# Altium schematic sheet Sheet2.SchDoc
size A2; SheetNumber: 1; SheetTotal: 1
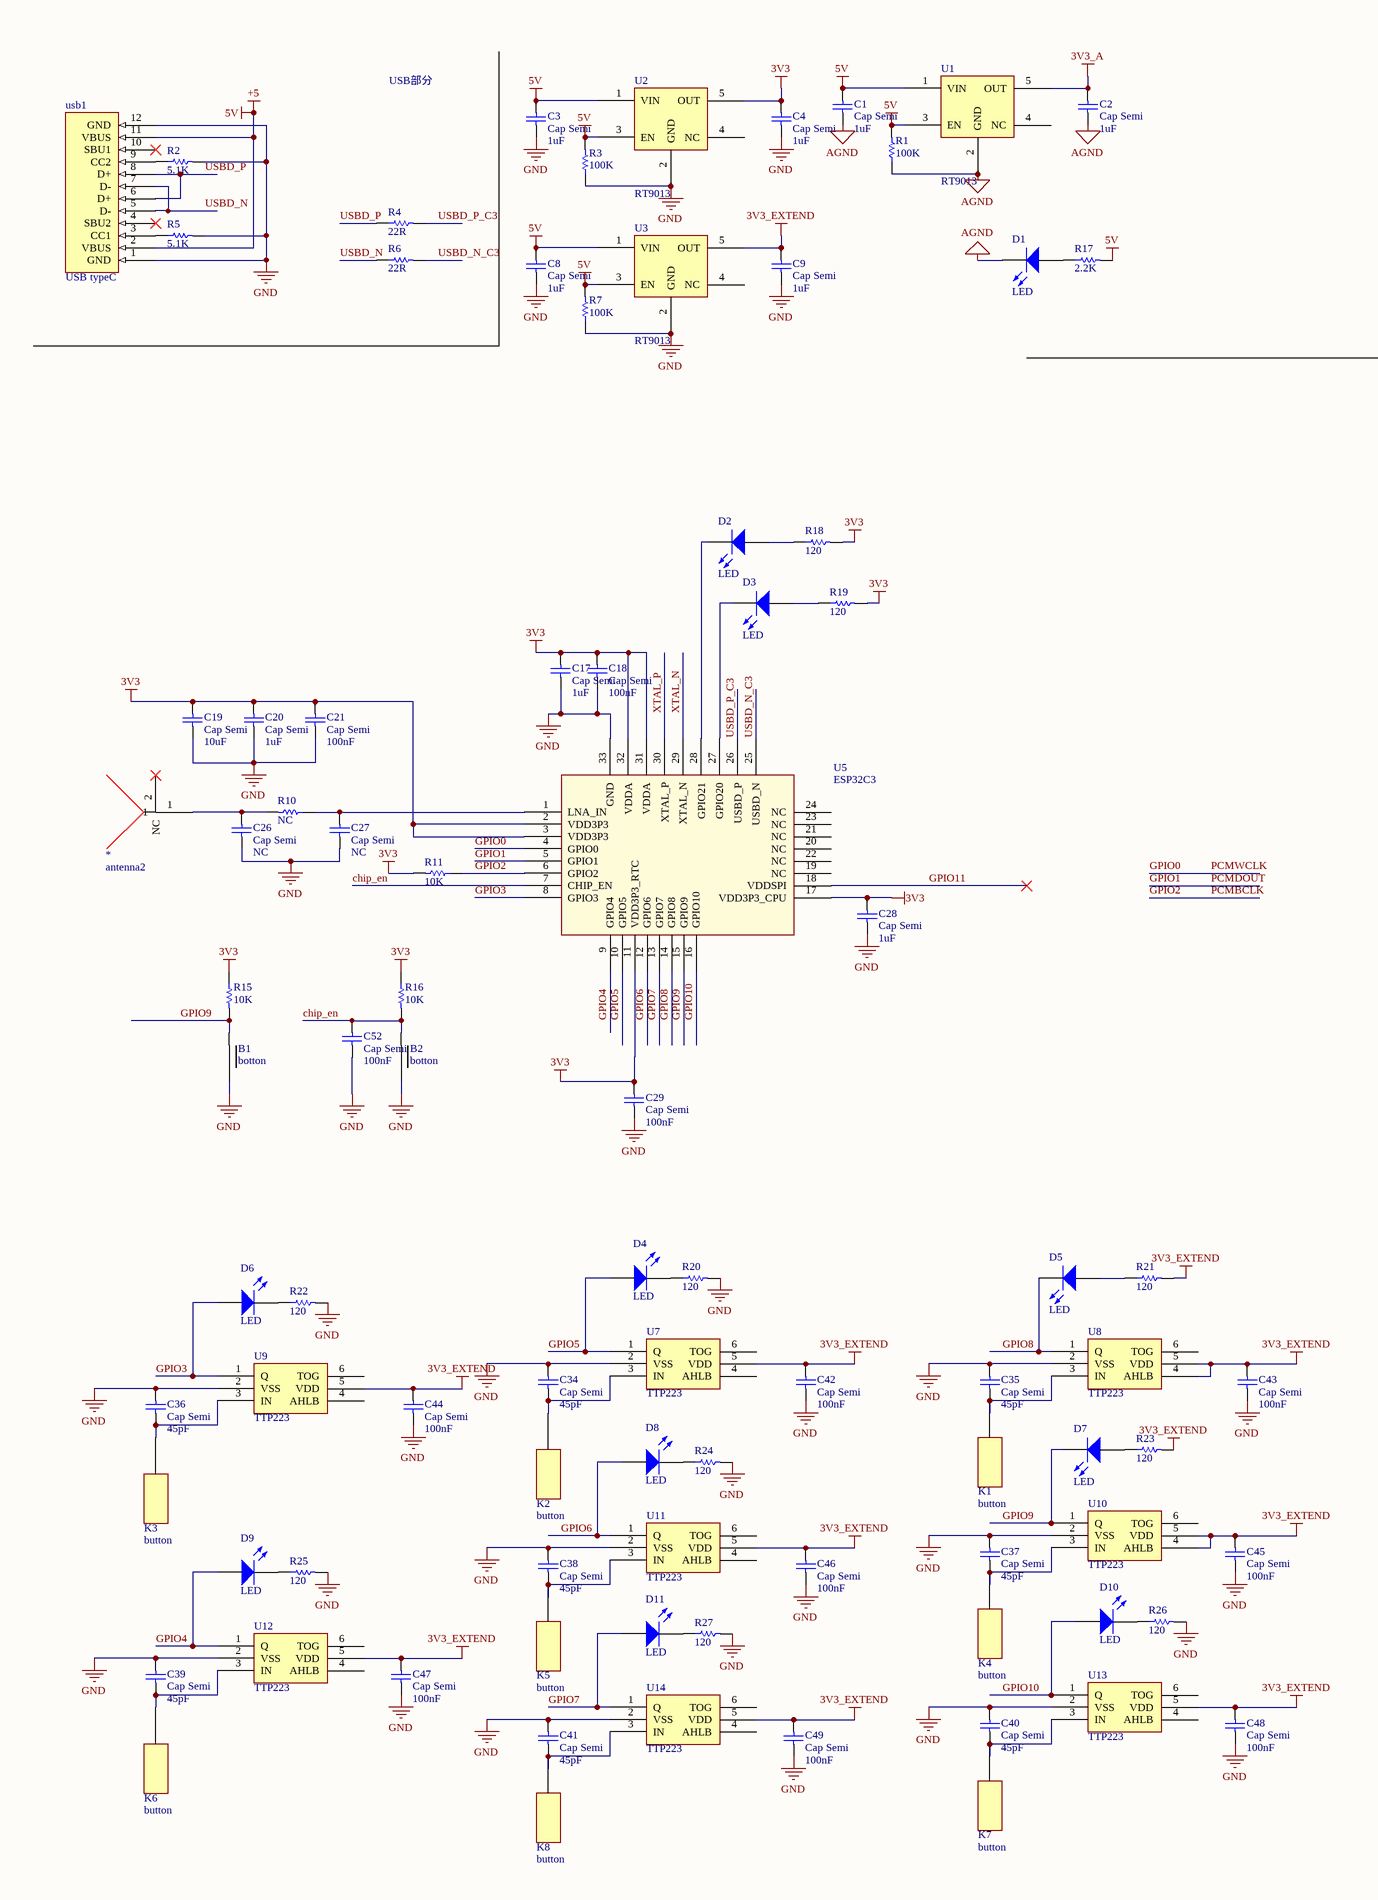
[diagram p0: Sheet2.SchDoc, left]
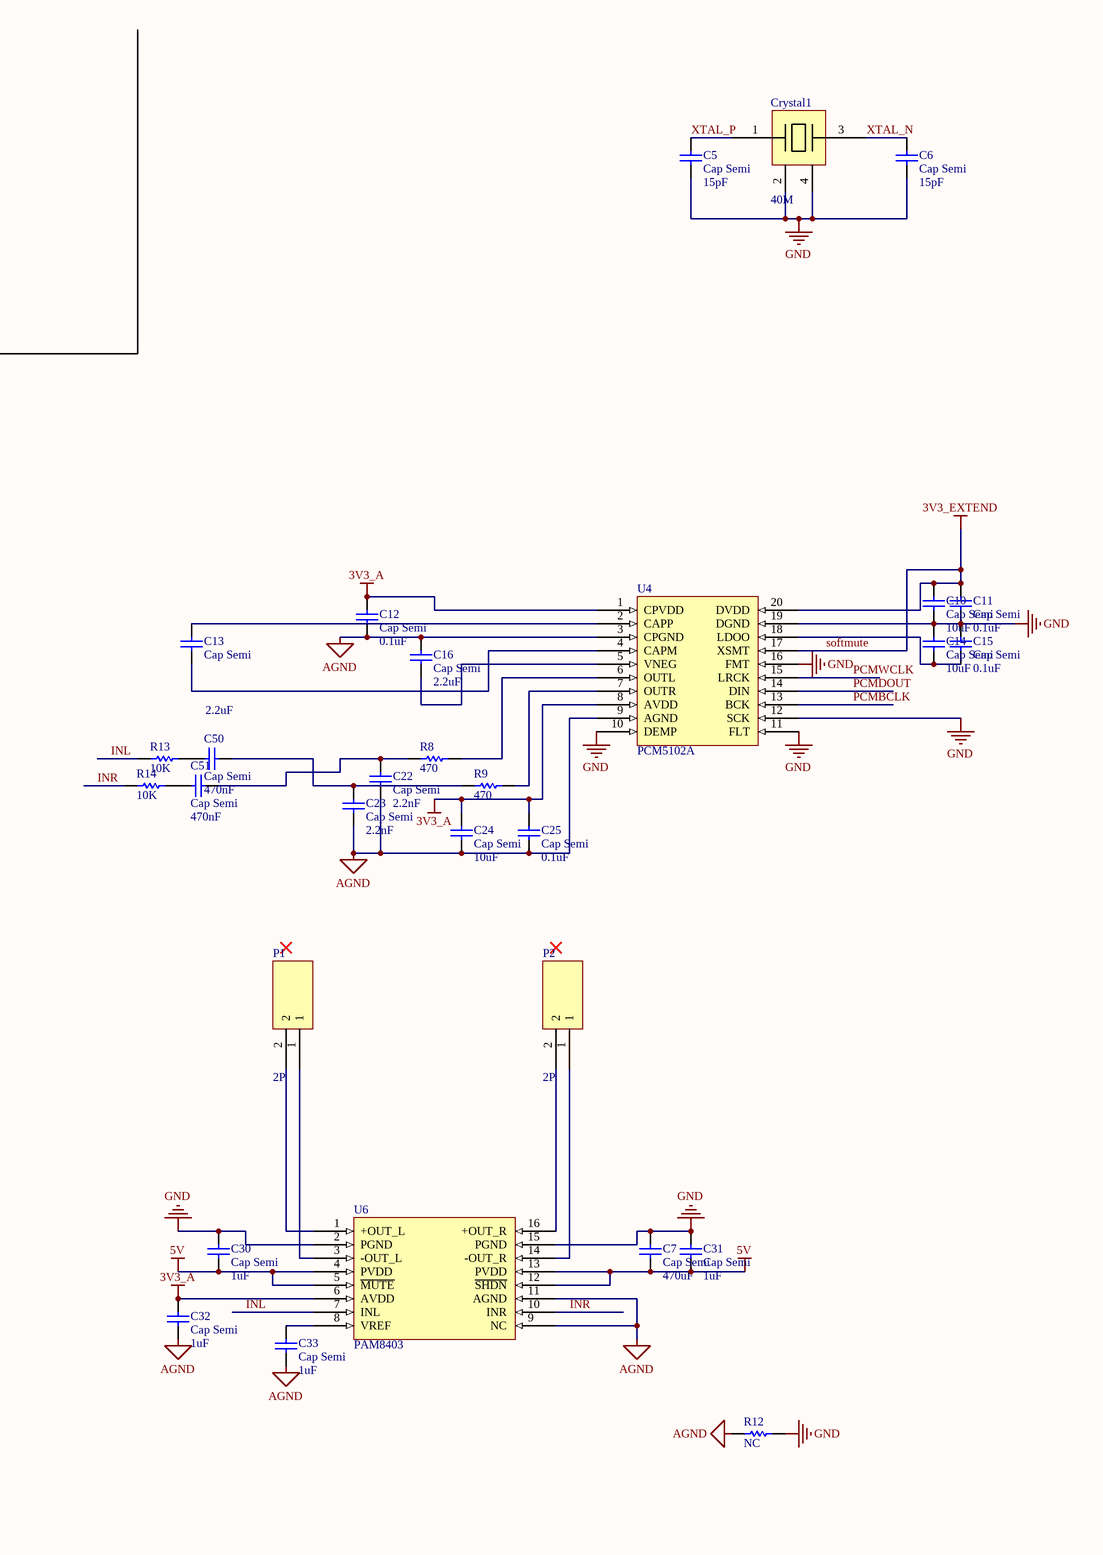
[diagram p1: Sheet2.SchDoc, right]

## Parts
*  antenna2  [antana]
B1  botton  [BOTTON_3*4]
B2  botton  [BOTTON_3*4]
C1  Cap Semi  value 1uF  [C1608[0603]]
C2  Cap Semi  value 1uF  [C1608[0603]]
C3  Cap Semi  value 1uF  [C1608[0603]]
C4  Cap Semi  value 1uF  [C1608[0603]]
C5  Cap Semi  value 15pF  [C1608[0603]]
C6  Cap Semi  value 15pF  [C1608[0603]]
C7  Cap Semi  value 470uF  [C1206]
C8  Cap Semi  value 1uF  [C1608[0603]]
C9  Cap Semi  value 1uF  [C1608[0603]]
C10  Cap Semi  value 10uF  [C1608[0603]]
C11  Cap Semi  value 0.1uF  [C1608[0603]]
C12  Cap Semi  value 0.1uF  [C1608[0603]]
C13  Cap Semi  value 2.2uF  [C1608[0603]]
C14  Cap Semi  value 10uF  [C1608[0603]]
C15  Cap Semi  value 0.1uF  [C1608[0603]]
C16  Cap Semi  value 2.2uF  [C1608[0603]]
C17  Cap Semi  value 1uF  [C1608[0603]]
C18  Cap Semi  value 100nF  [C1608[0603]]
C19  Cap Semi  value 10uF  [C0805]
C20  Cap Semi  value 1uF  [C1608[0603]]
C21  Cap Semi  value 100nF  [C1608[0603]]
C22  Cap Semi  value 2.2nF  [C1608[0603]]
C23  Cap Semi  value 2.2nF  [C1608[0603]]
C24  Cap Semi  value 10uF  [C1608[0603]]
C25  Cap Semi  value 0.1uF  [C1608[0603]]
C26  Cap Semi  value NC  [C1608[0603]]
C27  Cap Semi  value NC  [C1608[0603]]
C28  Cap Semi  value 1uF  [C1608[0603]]
C29  Cap Semi  value 100nF  [C1608[0603]]
C30  Cap Semi  value 1uF  [C1608[0603]]
C31  Cap Semi  value 1uF  [C1608[0603]]
C32  Cap Semi  value 1uF  [C1608[0603]]
C33  Cap Semi  value 1uF  [C1608[0603]]
C34  Cap Semi  value 45pF  [C1608[0603]]
C35  Cap Semi  value 45pF  [C1608[0603]]
C36  Cap Semi  value 45pF  [C1608[0603]]
C37  Cap Semi  value 45pF  [C1608[0603]]
C38  Cap Semi  value 45pF  [C1608[0603]]
C39  Cap Semi  value 45pF  [C1608[0603]]
C40  Cap Semi  value 45pF  [C1608[0603]]
C41  Cap Semi  value 45pF  [C1608[0603]]
C42  Cap Semi  value 100nF  [C1608[0603]]
C43  Cap Semi  value 100nF  [C1608[0603]]
C44  Cap Semi  value 100nF  [C1608[0603]]
C45  Cap Semi  value 100nF  [C1608[0603]]
C46  Cap Semi  value 100nF  [C1608[0603]]
C47  Cap Semi  value 100nF  [C1608[0603]]
C48  Cap Semi  value 100nF  [C1608[0603]]
C49  Cap Semi  value 100nF  [C1608[0603]]
C50  Cap Semi  value 470nF  [C1608[0603]]
C51  Cap Semi  value 470nF  [C1608[0603]]
C52  Cap Semi  value 100nF  [C1608[0603]]
Crystal1  40M  [3225 Crytsl]
D1  LED  [LED_0805]
D2  LED  [LED_0805]
D3  LED  [LED_0805]
D4  LED  [LED_0805]
D5  LED  [LED_0805]
D6  LED  [LED_0805]
D7  LED  [LED_0805]
D8  LED  [LED_0805]
D9  LED  [LED_0805]
D10  LED  [LED_0805]
D11  LED  [LED_0805]
K1  button  [button_touch]
K2  button  [button_touch]
K3  button  [button_touch]
K4  button  [button_touch]
K5  button  [button_touch]
K6  button  [button_touch]
K7  button  [button_touch]
K8  button  [button_touch]
P1  2P  [2Px1.25]
P2  2P  [2Px1.25]
R1  value 100K  [R0603]  (hidden comment: Res Semi)
R2  value 5.1K  [R0603]  (hidden comment: Res Semi)
R3  value 100K  [R0603]  (hidden comment: Res Semi)
R4  value 22R  [R0603]  (hidden comment: Res Semi)
R5  value 5.1K  [R0603]  (hidden comment: Res Semi)
R6  value 22R  [R0603]  (hidden comment: Res Semi)
R7  value 100K  [R0603]  (hidden comment: Res Semi)
R8  value 470  [R0603]  (hidden comment: Res Semi)
R9  value 470  [R0603]  (hidden comment: Res Semi)
R10  value NC  [R0603]  (hidden comment: Res Semi)
R11  value 10K  [R0603]  (hidden comment: Res Semi)
R12  value NC  [sigle_ground]  (hidden comment: Res Semi)
R13  value 10K  [R0603]  (hidden comment: Res Semi)
R14  value 10K  [R0603]  (hidden comment: Res Semi)
R15  value 10K  [R0603]  (hidden comment: Res Semi)
R16  value 10K  [R0603]  (hidden comment: Res Semi)
R17  value 2.2K  [R0805]  (hidden comment: Res Semi)
R18  value 120  [R0805]  (hidden comment: Res Semi)
R19  value 120  [R0805]  (hidden comment: Res Semi)
R20  value 120  [R0805]  (hidden comment: Res Semi)
R21  value 120  [R0805]  (hidden comment: Res Semi)
R22  value 120  [R0805]  (hidden comment: Res Semi)
R23  value 120  [R0805]  (hidden comment: Res Semi)
R24  value 120  [R0805]  (hidden comment: Res Semi)
R25  value 120  [R0805]  (hidden comment: Res Semi)
R26  value 120  [R0805]  (hidden comment: Res Semi)
R27  value 120  [R0805]  (hidden comment: Res Semi)
U1  RT9013  [SOT23-5]
U2  RT9013  [SOT23-5]
U3  RT9013  [SOT23-5]
U4  PCM5102A  [TSSOP20]
U5  ESP32C3  [QFN32 5x5_M]
U6  PAM8403  [SOP16]
U7  TTP223  [SOT23-6]
U8  TTP223  [SOT23-6]
U9  TTP223  [SOT23-6]
U10  TTP223  [SOT23-6]
U11  TTP223  [SOT23-6]
U12  TTP223  [SOT23-6]
U13  TTP223  [SOT23-6]
U14  TTP223  [SOT23-6]
usb1  USB typeC  [USB typeC]

## Nets
3V3: C4.2 C17.2 C18.2 C19.2 C20.2 C21.2 C28.2 C29.2 R11.2 R15.1 R16.1 R18.2 R19.2 U2.5(OUT) U5.2(VDD3P3) U5.3(VDD3P3) U5.11(VDD3P3_RTC) U5.17(VDD3P3_CPU) U5.31(VDDA) U5.32(VDDA)
3V3_A: C2.2 C12.2 C24.2 C25.2 C32.2 U1.5(OUT) U4.1(CPVDD) U4.8(AVDD) U6.6(AVDD)
+5: C1.2 C3.2 C7.1 C8.2 C30.1 C31.1 R1.2 R3.2 R7.2 R17.2 U1.1(VIN) U1.3(EN) U2.1(VIN) U2.3(EN) U3.1(VIN) U3.3(EN) U6.4(PVDD) U6.5(~{MUTE}) U6.12(~{SHDN}) U6.13(PVDD) usb1.2(VBUS) usb1.11(VBUS)  [also labelled 5V]
AGND: C1.1 C2.1 C12.1 C16.2 C22.1 C23.1 C24.1 C25.1 C32.1 C33.1 D1.2(K) R1.1 R12.1 U1.2(GND) U4.3(CPGND) U4.9(AGND) U6.9(NC) U6.11(AGND)
GND: B1.4 B2.4 C3.1 C4.1 C5.1 C6.1 C7.2 C8.1 C9.1 C10.1 C11.1 C14.2 C15.2 C17.1 C18.1 C19.1 C20.1 C21.1 C26.1 C27.1 C28.1 C29.1 C30.2 C31.2 C34.2 C35.2 C36.2 C37.2 C38.2 C39.2 C40.2 C41.2 C42.1 C43.1 C44.1 C45.1 C46.1 C47.1 C48.1 C49.1 C52.1 Crystal1.2 Crystal1.4 R2.2 R3.1 R5.2 R7.1 R12.2 R20.2 R22.2 R24.2 R25.2 R26.2 R27.2 U2.2(GND) U3.2(GND) U4.10(DEMP) U4.11(FLT) U4.12(SCK) U4.16(FMT) U4.19(DGND) U5.33(GND) U6.2(PGND) U6.15(PGND) U7.2(VSS) U8.2(VSS) U9.2(VSS) U10.2(VSS) U11.2(VSS) U12.2(VSS) U13.2(VSS) U14.2(VSS) usb1.1(GND) usb1.12(GND)
softmute: C9.2 C10.2 C11.2 C42.2 C43.2 C44.2 C45.2 C46.2 C47.2 C48.2 C49.2 R21.2 R23.2 U3.5(OUT) U4.17(XSMT) U4.20(DVDD) U7.5(VDD) U8.4(AHLB) U8.5(VDD) U9.5(VDD) U10.4(AHLB) U10.5(VDD) U11.5(VDD) U12.5(VDD) U13.5(VDD) U14.5(VDD)  [also labelled 3V3_EXTEND]
chip_en: B2.1 C52.2 R16.2 U5.7(CHIP_EN)
GPIO0: U4.15(LRCK) U5.4(GPIO0)  [also labelled PCMWCLK]
GPIO1: U4.14(DIN) U5.5(GPIO1)  [also labelled PCMDOUT]
GPIO2: R11.1 U4.13(BCK) U5.6(GPIO2)  [also labelled PCMBCLK]
GPIO3: D6.1(A) U5.8(GPIO3) U9.1(Q)
GPIO4: D9.1(A) U5.9(GPIO4) U12.1(Q)
GPIO5: D4.1(A) U5.10(GPIO5) U7.1(Q)
GPIO6: D8.1(A) U5.12(GPIO6) U11.1(Q)
GPIO7: D11.1(A) U5.13(GPIO7) U14.1(Q)
GPIO8: D5.2(K) U5.14(GPIO8) U8.1(Q)
GPIO9: B1.1 D7.2(K) R15.2 U5.15(GPIO9) U10.1(Q)
GPIO10: D10.1(A) U5.16(GPIO10) U13.1(Q)
GPIO11: U5.18(VDDSPI)
INL: R13.2 U6.7(INL)
INR: R14.2 U6.10(INR)
USBD_N: R6.1 usb1.5(D-) usb1.7(D-)
USBD_N_C3: R6.2 U5.25(USBD_N)
USBD_P: R4.1 usb1.6(D+) usb1.8(D+)
USBD_P_C3: R4.2 U5.26(USBD_P)
XTAL_N: C6.2 Crystal1.3 U5.29(XTAL_N)
XTAL_P: C5.2 Crystal1.1 U5.30(XTAL_P)
Net*_1: *.1 C26.2 R10.2
NetC13_1: C13.1 U4.4(CAPM)
NetC13_2: C13.2 U4.2(CAPP)
NetC14_1: C14.1 C15.1 U4.18(LDOO)
NetC16_1: C16.1 U4.5(VNEG)
NetC22_2: C22.2 C51.2 R8.2
NetC23_2: C23.2 C50.2 R9.2
NetC27_2: C27.2 R10.1 U5.1(LNA_IN)
NetC33_2: C33.2 U6.8(VREF)
NetC34_1: C34.1 K2.1 U7.3(IN)
NetC35_1: C35.1 K1.1 U8.3(IN)
NetC36_1: C36.1 K3.1 U9.3(IN)
NetC37_1: C37.1 K4.1 U10.3(IN)
NetC38_1: C38.1 K5.1 U11.3(IN)
NetC39_1: C39.1 K6.1 U12.3(IN)
NetC40_1: C40.1 K7.1 U13.3(IN)
NetC41_1: C41.1 K8.1 U14.3(IN)
NetC50_1: C50.1 R13.1
NetC51_1: C51.1 R14.1
NetD1_1: D1.1(A) R17.1
NetD2_1: D2.1(A) R18.1
NetD2_2: D2.2(K) U5.28(GPIO21)
NetD3_1: D3.1(A) R19.1
NetD3_2: D3.2(K) U5.27(GPIO20)
NetD4_2: D4.2(K) R20.1
NetD5_1: D5.1(A) R21.1
NetD6_2: D6.2(K) R22.1
NetD7_1: D7.1(A) R23.1
NetD8_2: D8.2(K) R24.1
NetD9_2: D9.2(K) R25.1
NetD10_2: D10.2(K) R26.1
NetD11_2: D11.2(K) R27.1
NetP1_1: P1.1 U6.3(-OUT_L)
NetP1_2: P1.2 U6.1(+OUT_L)
NetP2_1: P2.1 U6.14(-OUT_R)
NetP2_2: P2.2 U6.16(+OUT_R)
NetR2_1: R2.1 usb1.9(CC2)
NetR5_1: R5.1 usb1.3(CC1)
NetR8_1: R8.1 U4.6(OUTL)
NetR9_1: R9.1 U4.7(OUTR)

Not connected (* = marked no-connect by the designer): * 2(NC)*; U1 4(NC); U2 4(NC); U3 4(NC); U5 19(NC) 20(NC) 21(NC) 22(NC) 23(NC) 24(NC); U7 4(AHLB) 6(TOG); U8 6(TOG); U9 4(AHLB) 6(TOG); U10 6(TOG); U11 4(AHLB) 6(TOG); U12 4(AHLB) 6(TOG); U13 4(AHLB) 6(TOG); U14 4(AHLB) 6(TOG); usb1 4(SBU2)* 10(SBU1)*

## Notes on the sheet
- USB部分

## Library data of the parts
C1-C52 = Cap Semi: Capacitor (Semiconductor SIM Model); Published: 8-Jun-2000; LatestRevisionDate: 29-May-2009; LatestRevisionNote: IPC-7351 Footprint Added.; PackageReference: C1206; Publisher: Altium Limited; PackageDescription: Chip Capacitor
Crystal1 = Crytsl_4P
D1-D11 = LED: Typical INFRARED GaAs LED; Published: 8-Jun-2000; LatestRevisionDate: 08-Jul-2005; LatestRevisionNote: Mech Layer 1 removed.; PackageReference: LED-0; Publisher: Altium Limited; PackageDescription: LED; 2 Leads
K1-K8 = button_touch_square
R1-R27 = Res Semi: Semiconductor Resistor; Published: 8-Jun-2000; LatestRevisionDate: 17-Jul-2002; LatestRevisionNote: Re-released for DXP Platform.; PackageReference: AXIAL-0.5; Publisher: Altium Limited; PackageDescription: Axial Device, Thru-Hole; 2 Leads; 0.5 in Pin Spacing
U4 = PCM5120A